# EAGLE design PentaFnord_CtrlBoard_0_91 (EAGLE 6.2)
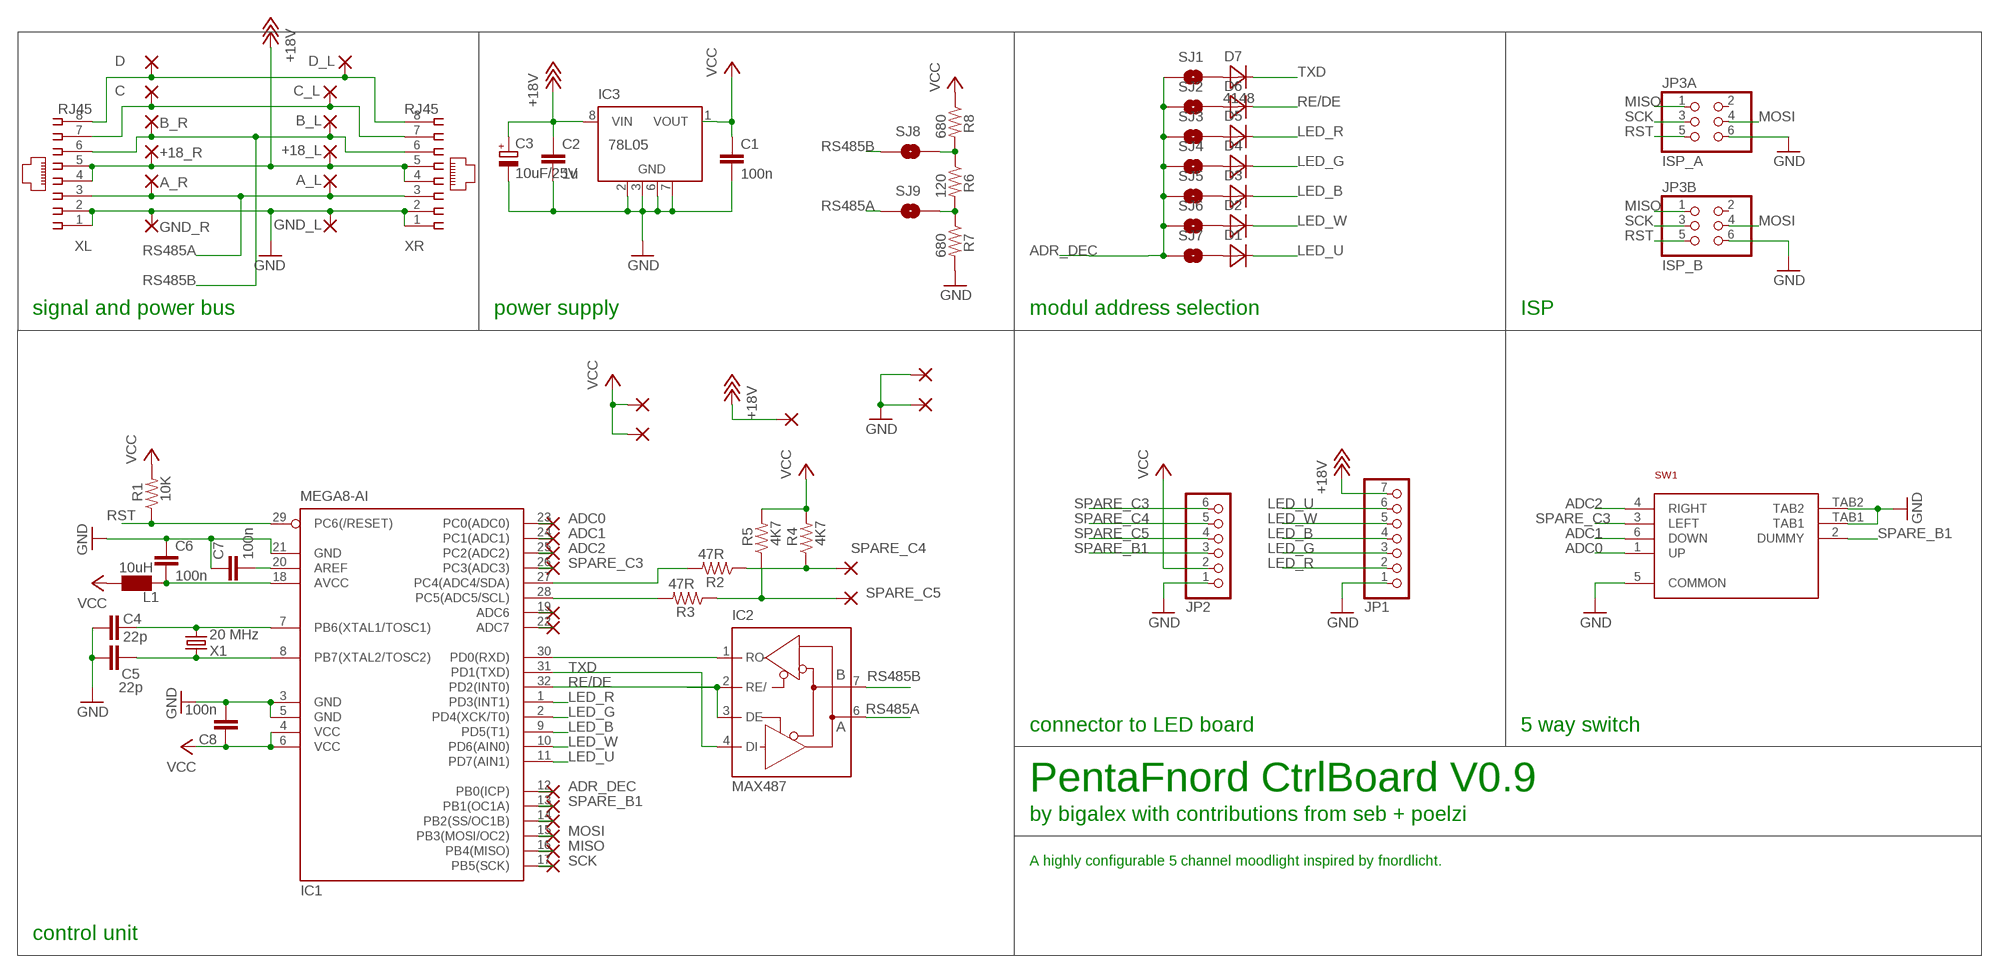
[diagram p0: schematic, sheet 1]

## Parts
+18_L  WIREPADSMD2,54-5,08  [SMD2,54-5,08]
+18_R  WIREPADSMD2,54-5,08  [SMD2,54-5,08]
A_L  WIREPADSMD1,27-254  [SMD1,27-2,54]
A_R  WIREPADSMD1,27-254  [SMD1,27-2,54]
ADC6  WIREPADSMD1,27-254  [SMD1,27-2,54]
ADC7  WIREPADSMD1,27-254  [SMD1,27-2,54]
B_L  WIREPADSMD1,27-254  [SMD1,27-2,54]
B_R  WIREPADSMD1,27-254  [SMD1,27-2,54]
C  WIREPADSMD1,27-254  [SMD1,27-2,54]
C1  100n  CAP0805  [0805]
C2  1u  CAP0805  [0805]
C3  10uF/25V  CPOL-EUSMCD  [SMC_D]
C4  22p  CAP0805  [0805]
C5  22p  CAP0805  [0805]
C6  100n  CAP0805  [0805]
C7  100n  CAP0805  [0805]
C8  100n  CAP0805  [0805]
C_L  WIREPADSMD1,27-254  [SMD1,27-2,54]
D  WIREPADSMD1,27-254  [SMD1,27-2,54]
D1  DIODE_0805  [DIODE_0805]
D2  DIODE_0805  [DIODE_0805]
D3  DIODE_0805  [DIODE_0805]
D4  DIODE_0805  [DIODE_0805]
D5  DIODE_0805  [DIODE_0805]
D6  DIODE_0805  [DIODE_0805]
D7  4148  DIODE_0805  [DIODE_0805]
D_L  WIREPADSMD1,27-254  [SMD1,27-2,54]
GND_L  WIREPADSMD2,54-5,08  [SMD2,54-5,08]
GND_R  WIREPADSMD2,54-5,08  [SMD2,54-5,08]
IC1  MEGA8-AI  [TQFP32-08]
IC2  MAX487  [SO08]
IC3  78L05  78L05SMD  [SO08]
JP1  PINHD-1X07_2.54-SMD-REVERSE  [1X07SMD-REVERSE]
JP2  PINHD-1X06_2.54-SMD  [1X06SMD]
JP3A  ISP_A  PINHD-2X03_2.54-SMD  [2X03SMD]
JP3B  ISP_B  PINHD-2X03_2.54-SMD  [2X03SMD]
L1  10uH  BEAD  [0805]
PAD1  WIREPADSMD1,27-254  [SMD1,27-2,54]
PAD2  WIREPADSMD1,27-254  [SMD1,27-2,54]
PAD3  WIREPADSMD1,27-254  [SMD1,27-2,54]
PAD4  WIREPADSMD1,27-254  [SMD1,27-2,54]
PAD5  WIREPADSMD1,27-254  [SMD1,27-2,54]
PB0  WIREPADSMD1,27-254  [SMD1,27-2,54]
PB1  WIREPADSMD1,27-254  [SMD1,27-2,54]
PB2  WIREPADSMD1,27-254  [SMD1,27-2,54]
PB3  WIREPADSMD1,27-254  [SMD1,27-2,54]
PB4  WIREPADSMD1,27-254  [SMD1,27-2,54]
PB5  WIREPADSMD1,27-254  [SMD1,27-2,54]
PC0  WIREPADSMD1,27-254  [SMD1,27-2,54]
PC1  WIREPADSMD1,27-254  [SMD1,27-2,54]
PC2  WIREPADSMD1,27-254  [SMD1,27-2,54]
PC3  WIREPADSMD1,27-254  [SMD1,27-2,54]
PC4  WIREPADSMD1,27-254  [SMD1,27-2,54]
PC5  WIREPADSMD1,27-254  [SMD1,27-2,54]
R1  10K  RESISTOR0805-RES  [0805]
R2  47R  RESISTOR0805-RES  [0805]
R3  47R  RESISTOR0805-RES  [0805]
R4  4K7  RESISTOR0805-RES  [0805]
R5  4K7  RESISTOR0805-RES  [0805]
R6  120  RESISTOR0805-RES  [0805]
R7  680  RESISTOR0805-RES  [0805]
R8  680  RESISTOR0805-RES  [0805]
SJ1  SOLDERJUMPERNO  [SJ_2S-NO]
SJ2  SOLDERJUMPERNO  [SJ_2S-NO]
SJ3  SOLDERJUMPERNO  [SJ_2S-NO]
SJ4  SOLDERJUMPERNO  [SJ_2S-NO]
SJ5  SOLDERJUMPERNO  [SJ_2S-NO]
SJ6  SOLDERJUMPERNO  [SJ_2S-NO]
SJ7  SOLDERJUMPERNO  [SJ_2S-NO]
SJ8  SOLDERJUMPERNO  [SJ_2S-NO]
SJ9  SOLDERJUMPERNO  [SJ_2S-NO]
SW1  MCMT5-F-VADAPTED_FOOTPRINT  [MCMT5-F-V_ADAPTED]
X1  20 MHz  CRYSTALSMD-SMALLER  [HC49UP-SMALL]
XL  RJ45  RJ45-SMDRJ45-SMALL  [85502-5008-SMALL]
XR  RJ45  RJ45-SMDRJ45-SMALL  [85502-5008-SMALL]

## Nets
+18V: +18_L.1(P) +18_R.1(P) C2.1 C3.+ IC3.8(VIN) JP1.7 PAD2.1(P) XL.4 XL.5 XR.4 XR.5
ADC0: IC1.23(PC0(ADC0)) PC0.1(P) SW1.1(UP)
ADC1: IC1.24(PC1(ADC1)) PC1.1(P) SW1.6(DOWN)
ADC2: IC1.25(PC2(ADC2)) PC2.1(P) SW1.4(RIGHT)
ADR_DEC: IC1.12(PB0(ICP)) PB0.1(P) SJ1.1 SJ2.1 SJ3.1 SJ4.1 SJ5.1 SJ6.1 SJ7.1
GND: C1.2 C2.2 C3.- C4.1 C5.1 C6.1 C7.1 C8.2 GND_L.1(P) GND_R.1(P) IC1.3(GND) IC1.5(GND) IC1.21(GND) IC3.2(GND) IC3.3(GND) IC3.6(GND) IC3.7(GND) JP1.1 JP2.1 JP3A.6 JP3B.6 PAD1.1(P) PAD5.1(P) R7.2 SW1.5(COMMON) SW1.TAB1 SW1.TAB2 XL.1 XL.2 XR.1 XR.2
LED_B: D3.1(C) IC1.9(PD5(T1)) JP1.4
LED_G: D4.1(C) IC1.2(PD4(XCK/T0)) JP1.3
LED_R: D5.1(C) IC1.1(PD3(INT1)) JP1.2
LED_U: D1.1(C) IC1.11(PD7(AIN1)) JP1.6
LED_W: D2.1(C) IC1.10(PD6(AIN0)) JP1.5
MISO: IC1.16(PB4(MISO)) JP3A.1 JP3B.1 PB4.1(P)
MOSI: IC1.15(PB3(MOSI/OC2)) JP3A.4 JP3B.4 PB3.1(P)
N$1: C.1(P) C_L.1(P) XL.7 XR.7
N$2: D.1(P) D_L.1(P) XL.8 XR.8
N$4: ADC6.1(P) IC1.19(ADC6)
N$9: ADC7.1(P) IC1.22(ADC7)
N$30: C6.2 IC1.18(AVCC) L1.2
N$31: R6.1 R8.2 SJ8.2
N$32: IC1.30(PD0(RXD)) IC2.1(RO)
N$35: C5.2 IC1.8(PB7(XTAL2/TOSC2)) X1.2
N$36: C4.2 IC1.7(PB6(XTAL1/TOSC1)) X1.1
N$38: R6.2 R7.1 SJ9.2
N$44: C7.2 IC1.20(AREF)
N$45: D7.2(A) SJ1.2
N$46: D6.2(A) SJ2.2
N$47: D5.2(A) SJ3.2
N$48: D4.2(A) SJ4.2
N$50: D3.2(A) SJ5.2
N$51: D2.2(A) SJ6.2
N$52: D1.2(A) SJ7.2
N$53: IC1.28(PC5(ADC5/SCL)) R3.2
N$55: IC1.14(PB2(SS/OC1B)) PB2.1(P)
N$59: IC1.27(PC4(ADC4/SDA)) R2.2
RE/DE: D6.1(C) IC1.32(PD2(INT0)) IC2.2(RE/) IC2.3(DE)
RS485A: A_L.1(P) A_R.1(P) IC2.6(A) SJ9.1 XL.3 XR.3
RS485B: B_L.1(P) B_R.1(P) IC2.7(B) SJ8.1 XL.6 XR.6
RST: IC1.29(PC6(/RESET)) JP3A.5 JP3B.5 R1.1
SCK: IC1.17(PB5(SCK)) JP3A.3 JP3B.3 PB5.1(P)
SPARE_B1: IC1.13(PB1(OC1A)) JP2.3 PB1.1(P) SW1.2(DUMMY)
SPARE_C3: IC1.26(PC3(ADC3)) JP2.6 PC3.1(P) SW1.3(LEFT)
SPARE_C4: JP2.5 PC4.1(P) R2.1 R4.1
SPARE_C5: JP2.4 PC5.1(P) R3.1 R5.1
TXD: D7.1(C) IC1.31(PD1(TXD)) IC2.4(DI)
VCC: C1.1 C8.1 IC1.4(VCC) IC1.6(VCC) IC3.1(VOUT) JP2.2 L1.1 PAD3.1(P) PAD4.1(P) R1.2 R4.2 R5.2 R8.1
Unconnected: IC3.4(NC) IC3.5(NC) JP3A.2 JP3B.2

## Notes on the sheet
- signal and power bus | power supply | modul address selection | ISP
- connector to LED board | 5 way switch
- PentaFnord CtrlBoard V0.9
- by bigalex with contributions from seb + poelzi
- A highly configurable 5 channel moodlight inspired by fnordlicht.
- control unit

## Power pins joined to a net without a drawn wire
GND: IC2.5(GND)
VCC: IC2.8(VCC)

## Library data of the parts
+18_L +18_R A_L A_R ADC6 ADC7 B_L B_R C C_L D D_L GND_L GND_R PAD1-PAD5 PB0 PB1-PB5 PC0 PC1-PC5 = wirepad:WIREPAD: Wire PAD connect wire on PCB
C1 C2 C4-C8 = SparkFun:CAP: Capacitor Standard 0603 ceramic capacitor, and 0.1" leaded capacitor.
C3 = rcl:CPOL-EU: POLARIZED CAPACITOR, European symbol
D1-D7 = seb:DIODE_0805
IC1 = atmel:MEGA8: MICROCONTROLLER 8 Kbytes FLASH, 1 kbytes SRAM, 512 bytes EEPROM, USART, 6-channel 10 bit ADC, 2-channel 8 bit ADC Pin compatible with Atmega48, ATMega88, ATMega168 Source: avr.lbr; MPN: ATMEGA8-16AU; OC_FARNELL: 9171371; OC_NEWARK: 73M8863
IC2 = Alex_personal:MAX487: RS485 TRANSEIVER; MF: MAXIM; MPN: MAX487; OC_FARNELL: unknown; OC_NEWARK: unknown
IC3 = linear:78L*SMD: Positive VOLTAGE REGULATOR
JP1 = Alex_personal:PINHD-1X07: PIN HEADER
JP2 = pinhead-2:PINHD-1X06: PIN HEADER
JP3A JP3B = pinhead-2:PINHD-2X03: PIN HEADER
L1 = seb:BEAD
R1-R8 = SparkFun:RESISTOR: Resistor Basic schematic elements and footprints for 0603, 1206, and PTH resistors.
SJ1-SJ9 = SparkFun:SOLDERJUMPER: Solder Jumper Standard SMD solder jumper. Used to automate production. Two varients : Normally Open and Normally Closed are the same, but have different paste layers. NC will have a large amount of paste and should jumper during reflow.
SW1 = alex3:MCMT5-F-V
X1 = Alex_personal:CRYSTAL: Crystals Various standard crystals. Proven footprints. Spark Fun Electronics SKU : COM-00534
XL XR = Alex_personal:RJ45-SMD: AMP connector

## Board
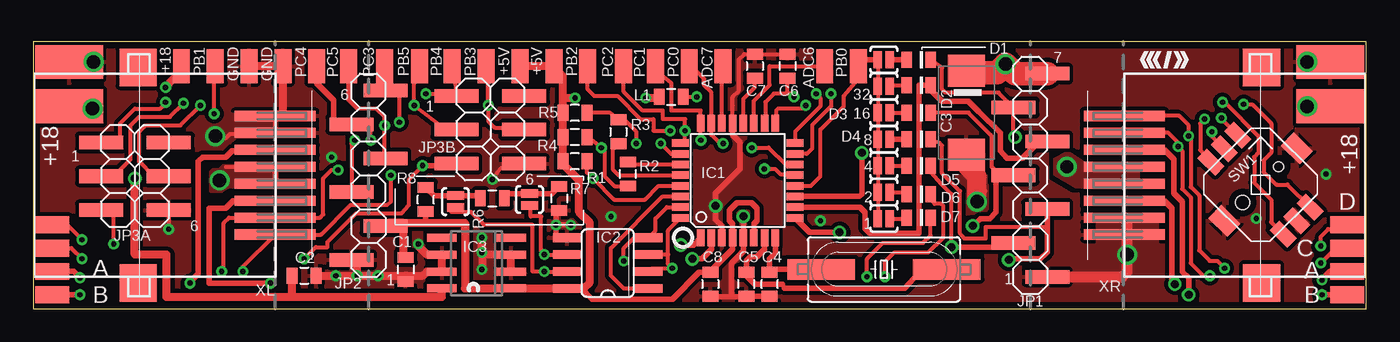
[diagram p1: board, top side]
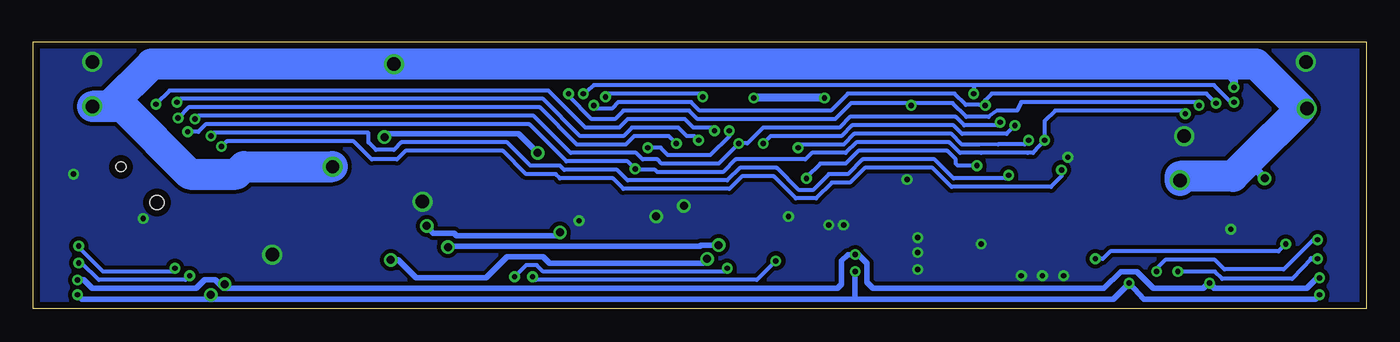
[diagram p2: board, bottom side, seen from below]

Size 100 x 20 mm. Coordinates in mm from the lower left corner, seen from the top.
Outline: 100,0 100,20 0,20 0,0 100,0
Copper layers (1*16): Top 0.035mm / dielectric 1.5mm / Bottom 0.035mm
Design rules: minimum track width 12mil, minimum drill 0.4mm, track to track 10mil, track to pad 10mil, pad to pad 8mil, via to via 10mil, smd to smd 8mil, copper to edge 20mil, drill to drill 8mil, minimum pad ring 10mil, minimum via ring 8mil, stop-mask expansion 4mil, vias tented up to drill 40mil, thermal gap 10mil

### Footprints (pad centres in the part's own frame; a part is rotated, then mirrored left to right if it is on the bottom)
SMD2,54-5,08 = smd 2.54 x 5.08: 1 0,0
SMD1,27-2,54 = smd 1.27 x 2.54: 1 0,0
0805 = smd 0.8 x 1.2: 1 -0.9,0; 2 0.9,0
SMC_D = smd 2.4 x 2.8: + -3.15,0; - 3.15,0
DIODE_0805 = smd 0.8 x 1.2: 1 -0.9,0; 2 0.9,0
TQFP32-08 = smd 1.27 x 0.559: 1 -4.293,2.8; 2 -4.293,2; 3 -4.293,1.2; 4 -4.293,0.4; 5 -4.293,-0.4; 6 -4.293,-1.2; 7 -4.293,-2; 8 -4.293,-2.8; 17 4.293,-2.8; 18 4.293,-2; 19 4.293,-1.2; 20 4.293,-0.4; 21 4.293,0.4; 22 4.293,1.2; 23 4.293,2; 24 4.293,2.8 | smd 0.559 x 1.27: 9 -2.8,-4.293; 10 -2,-4.293; 11 -1.2,-4.293; 12 -0.4,-4.293; 13 0.4,-4.293; 14 1.2,-4.293; 15 2,-4.293; 16 2.8,-4.293; 25 2.8,4.293; 26 2,4.293; 27 1.2,4.293; 28 0.4,4.293; 29 -0.4,4.293; 30 -1.2,4.293; 31 -2,4.293; 32 -2.8,4.293
SO08 = smd 0.66 x 2.032: 1 -1.905,-3.073; 2 -0.635,-3.073; 3 0.635,-3.073; 4 1.905,-3.073; 5 1.905,3.073; 6 0.635,3.073; 7 -0.635,3.073; 8 -1.905,3.073
SO08' = smd 0.6 x 2.2: 1 -1.905,-2.6; 2 -0.635,-2.6; 3 0.635,-2.6; 4 1.905,-2.6; 5 1.905,2.6; 6 0.635,2.6; 7 -0.635,2.6; 8 -1.905,2.6
1X07SMD-REVERSE = smd 1.016 x 3.302: 1 -1.27,-1.27; 2 1.27,1.27; 3 3.81,-1.27; 4 6.35,1.27; 5 8.89,-1.27; 6 11.43,1.27; 7 13.97,-1.27
1X06SMD = smd 1.016 x 3.302: 1 -1.27,1.27; 2 1.27,-1.27; 3 3.81,1.27; 4 6.35,-1.27; 5 8.89,1.27; 6 11.43,-1.27
2X03SMD = smd 1.016 x 3.302: 1 -1.27,-3.81; 2 -1.27,1.27; 3 1.27,-3.81; 4 1.27,1.27; 5 3.81,-3.81; 6 3.81,1.27
SJ_2S-NO = smd 0.635 x 1.27: 1 -0.45,0; 2 0.45,0
MCMT5-F-V_ADAPTED = smd 1.858 x 1: 1 -3.829,1.425; 2 -3.829,0; 3 -3.829,-1.425; 4 3.829,1.425; 5 3.829,0; 6 3.829,-1.425 | smd 2 x 1.394: TAB1 0,3.847; TAB2 0,-3.847 | hole 1.05: 0,-1.9 | hole 0.75: 0,1.9
HC49UP-SMALL = smd 5.08 x 1.524: 1 -4.699,0; 2 4.699,0
85502-5008-SMALL = smd 6.096 x 0.762: 1 10.211,4.445; 2 10.211,3.175; 3 10.211,1.905; 4 10.211,0.635; 5 10.211,-0.635; 6 10.211,-1.905; 7 10.211,-3.175; 8 10.211,-4.445 | smd 2.794 x 2.794: P$1 -0.076,-8.077; P$2 -0.076,8.077

### Placement (x,y rotation side)
+18_L  2.7,15.16 90 top
+18_R  97.31,15.16 90 top
A_L  1.43,2.78 90 top
A_R  98.58,2.78 90 top
ADC6  59.37,18.18 0 top
ADC7  51.75,18.18 180 top
B_L  1.43,1.04 90 top
B_R  98.58,1.04 90 top
C  98.58,4.53 90 top
C1  27.94,2.94 270 top
C2  20.32,2.46 0 top
C3  70.01,14.69 270 top
C4  53.5,1.83 90 top
C5  55.24,1.83 90 top
C6  56.59,18.18 270 top
C7  54.13,18.18 270 top
C8  50.8,1.83 270 top
C_L  1.43,4.53 90 top
D  98.58,6.27 90 top
D1  66.44,18.66 180 top
D2  66.44,16.75 180 top
D3  66.44,14.69 180 top
D4  66.44,12.7 180 top
D5  66.44,10.72 180 top
D6  66.44,8.58 180 top
D7  66.44,6.83 180 top
D_L  1.43,6.27 270 top
GND_L  2.7,18.5 90 top
GND_R  97.31,18.5 90 top
IC1  52.86,9.61 90 top
IC2  43.1,3.42 90 top
IC3  78L05  [SO08']  33.26,3.42 90 top
JP1  74.8,3.65 90 top
JP2  25.15,4.92 90 top
JP3A  8.89,11.19 270 top
JP3B  35.56,14.69 270 top
L1  47.86,15.88 0 top
PAD1  16.19,18.18 0 top
PAD2  11.11,18.18 0 top
PAD3  39.05,18.18 0 top
PAD4  36.51,18.18 0 top
PAD5  18.73,18.18 0 top
PB0  61.91,18.18 180 top
PB1  13.65,18.18 180 top
PB2  41.59,18.18 180 top
PB3  33.97,18.18 180 top
PB4  31.43,18.18 180 top
PB5  28.97,18.18 180 top
PC0  49.21,18.18 0 top
PC1  46.67,18.18 0 top
PC2  44.29,18.18 0 top
PC3  26.35,18.18 0 top
PC4  21.27,18.18 0 top
PC5  23.65,18.18 0 top
R1  40.64,11.04 180 top
R2  44.61,10.08 90 top
R3  43.89,13.26 270 top
R4  40.64,12.86 180 top
R5  40.64,14.69 180 top
R6  34.45,8.26 0 top
R7  39.45,8.26 270 top
R8  29.45,8.18 90 top
SJ1  63.82,6.75 0 top
SJ2  63.82,8.73 0 top
SJ3  63.82,10.72 0 top
SJ4  63.82,12.7 0 top
SJ5  63.82,14.69 0 top
SJ6  63.82,16.67 0 top
SJ7  63.82,18.66 0 top
SJ8  31.67,8.02 90 top
SJ9  37.23,8.18 90 top
SW1  92.08,9.29 315 top
X1  63.82,2.94 180 top
XL  7.94,10 0 top
XR  92.08,10 180 top

### Tracks (layer width: path | path; a pad name or v marks a point on that pad's centre or on a via)
+18V  (via drill 0.4, 0.6, 1)
  Top 0.305: 11.11,17.86 PAD2.1 | +18_L.1 | 14.45,10.63 XL.4
  Top 0.406: 97.16,15.16 +18_R.1 | XL.4 XL.5 | XR.5 81.76,10.62 | v4.45,15.01 +18_L.1 1.59,14.53 | 13.49,9.45 14.13,9.61 | 97.16,15.16 | v95.57,15.16 97.16,15.16
  Top 0.61: 19.53,0.88 30.66,0.88 IC3.8 | C2.1 19.42,0.98 19.53,0.88 | JP1.7 75.64,17.62 75.56,17.7 | v9.92,16.59 11.11,17.86 | 70.14,17.7 arc-90 C3.+ | v7.62,9.77 7.62,4.05 10,4.05 10,0.88 19.53,0.88
  Top 1.778: 70.14,17.7 72.31,17.7 v72.95,18.34 73.67,17.62 JP1.7
  Bottom 0.305: 9.53,18.33 10.32,17.54 | 5.4,14.53 4.6,14.53 4.45,14.37 v4.45,15.01 5.56,14.53 5.4,14.53 | 4.92,15.01 5.4,14.53 | v13.97,9.61 14.45,10.4 14.45,9.92 13.97,9.92
  Bottom 0.406: 42.55,18.81 43.34,18.81 43.34,18.33 | 73.74,17.7 74.14,18.34 77.95,18.33
  Bottom 0.61: 10.32,17.54 9.92,17.14 v9.92,16.59 | 73.74,17.7 73.1,18.34 v72.95,18.34 | v7.62,9.77 8.81,11.12
  Bottom 2.311: v13.97,9.61 13.97,9.92 10,9.92 8.81,11.12 4.92,15.01 8.25,18.33 9.53,18.33 43.34,18.33 77.95,18.33 91.13,18.33 94.3,15.16 v95.57,15.16 93.34,15.16 88.27,10.08 84.77,10.08 84.22,10.64 v77.55,10.64
  pour Top (no thermals): 82.87,10.88 82.87,9.13 78.26,9.13 76.68,10.08 76.68,11.19 77.63,11.67 78.9,10.88
  pour Top (no thermals): 13.49,10.4 13.97,10.4 14.29,10.72 18.1,10.72 18.26,10.56 18.26,9.45 15.24,9.45 14.92,9.13 14.61,9.13 14.13,8.81 13.34,8.81 13.34,10.24
ADC0  (via drill 0.4)
  Top 0.305: PC0.1 49.37,17.23 | 49.37,17.23 | PC0.1 49.21,17.39 | PC0.1 49.37,18.18 50.32,17.23 50.32,16.75 50.86,16.21 IC1.23 50.86,13.04 51.51,12.39 v51.75,12.39 | v89.14,14.29 89.14,14.24 SW1.1
  Bottom 0.305: v51.75,12.39 52.31,12.94 54.93,12.94 55.56,12.31 59.21,12.31 61.99,15.08 88.34,15.08 v89.14,14.29
ADC1  (via drill 0.4, 0.4 pad 0.01)
  Top 0.305: PC1.1 46.83,18.02 46.83,17.7 46.91,17.7 47.86,16.91 47.86,14.85 50.07,14.85 IC1.24 50.06,12.65 v50.09,12.62 | SW1.6 92.87,6.48 92.87,8.18 91.6,9.45 91.6,11.35 91.92,11.67 91.92,12.94 89.38,15.48 v89.22,15.48
  Bottom 0.305: v50.09,12.62 50.4,12.94 50.96,12.94 51.59,13.58 55.09,13.58 55.72,12.94 58.98,12.94 61.75,15.72 88.98,15.72 v89.22,15.48
ADC2  (via drill 0.4)
  Top 0.305: IC1.25 48.9,12.41 v48.9,13.34 48.9,14.21 47.23,14.21 47.23,14.85 45.72,14.85 44.29,16.28 PC2.1 | SW1.4 94.09,9.29 93.27,9.29 92.31,10.24 92.31,11.12 92.87,11.67 92.87,13.89 91.44,15.32 v90.81,15.32
  Bottom 0.305: v48.9,13.34 49.13,13.58 50.48,13.58 51.12,14.21 55.4,14.21 56.04,13.58 58.58,13.58 61.36,16.35 89.77,16.35 v90.81,15.32
ADR_DEC
  Top 0.305: SJ7.1 SJ6.1 | 62.05,18.61 61.91,18.47 61.91,17.23 60.8,15.96 60.8,15.16 59.05,13.42 59.05,9.92 58.34,9.21 IC1.12 57.08,9.13 | SJ1.1 63.37,6.35 SJ2.1 SJ3.1 SJ4.1 | SJ6.1 | SJ6.1 | SJ6.1 SJ5.1 SJ4.1 | SJ4.1
  Top 0.406: PB0.1 62.05,18.61 62.07,18.66 SJ7.1
GND  (via drill 0.4, 0.6, 1)
  Top 0.305: C7.1 53.34,19.08 52.94,18.68 52.94,16.35 52.46,15.88 52.46,15.25 IC1.21 | 36.83,10.56 35.08,10.56 v34.45,9.69 | C7.1 | C7.1 C6.1 | 88.58,6.59 SW1.TAB2 | XL.1 XL.2 18.2,13.1 14.76,13.1 14.45,12.78 | v13.65,12.94 14.45,12.78 | 13.65,13.26 13.97,13.26 14.45,12.78 | 13.65,12.39 13.57,12.54 13.18,12.94 | JP3A.6 v10.16,5.96 | JP3A.6
  Top 0.406: 96.52,17.86 GND_R.1 | IC2.5 39.21,5.32 v39.21,6.27 | v39.21,6.27 v40.32,6.27 | 36.83,10.56 JP3B.6 | R7.2 39.21,7.12 v39.21,6.27 | IC1.21 52.46,13.02 53.02,12.47 53.02,10.48 51.2,8.66 v51.2,7.7 51.2,6.67 51.66,6.2 IC1.3 | 53.26,4.29 IC1.5 v53.26,6.91 | 52.39,0.88 53.45,0.88 C4.1 C5.1 | 53.26,4.29 | 53.26,4.29 52.39,3.42 52.39,0.88 | 52.39,0.88 50.85,0.88 C8.2
  Top 0.61: 10.95,7.38 JP3A.6 9.84,7.54 | 3.02,18.18 3.49,18.18 3.25,17.94 3.02,18.18 | 3.02,18.18 GND_L.1 | 3.02,18.18 | 22.54,3.73 23.79,3.73 JP2.1 24.29,3.24 v24.29,2.46 | C2.2 v22.7,2.46 | v22.7,2.46 | v22.7,2.46 v24.29,2.46 | v24.29,2.46 | v24.29,2.46 27.94,2.46 | 27.94,2.46 29.21,2.46 29.53,2.78 IC3.7 IC3.6 29.53,4.05 28.89,4.69 v28.89,4.84 | 27.94,2.46 C1.2 | IC3.2 IC3.3 33.81,4.05 arc-90 v33.66,4.21 | v33.66,4.21 v33.66,2.94 | v33.66,4.21 v33.66,5.32 | PAD1.1 PAD5.1 18.73,14.45 XL.1 | 71.28,8.81
  Top 0.813: 82.07,5.89 82.07,6.49 XR.2 | 82.07,5.89 v82.07,4.05 82.07,2.78 81.67,2.38 JP1.1 | 82.07,5.89 XR.1
  Top 1.422: v70.8,8.02 70.8,8.66 70.8,9.92 70.01,10.72 C3.-
  other vias: 4.52,18.5 95.57,18.5 97,10.08 91.76,6.75 25.88,2.46 43.34,6.91 22.38,11.35 59.05,6.59
  pour Bottom (isolate 0.305): -0.16,-0.08 100.17,-0.08 100.17,20.09 -0.16,20.09
  pour Top (isolate 0.305, rank 2): 100.17,20.09 100.17,-0.08 -0.16,-0.08 -0.16,20.09
  pour Top (no thermals): 79.85,3.42 79.85,6.59 84.3,6.59 84.3,3.42
  pour Top (no thermals): 18.26,14.53 14.76,14.53 13.97,13.58 13.02,13.26 13.02,12.47 13.34,12.15 13.81,12.15 14.13,12.47 14.76,12.47 15.24,12.94 18.26,12.94
LED_B  (via drill 0.6)
  Top 0.305: 73.18,9.77 73.3,9.77 JP1.4 | D3.1 70.17,14.69 71.91,12.94 71.91,10.63 72.55,10
  Top 0.406: IC1.9 58.24,5.72 v60.48,5.72 | 72.31,10 72.23,10.08 | 72.31,10 72.55,10 JP1.4 | v70.48,6.2 71.04,6.75 71.75,6.75 72.23,7.23 72.23,9.92 72.31,10
  Bottom 0.406: v70.48,6.2 70.01,5.64 68.42,5.64 68.26,5.48 60.72,5.48 v60.48,5.72
LED_G  (via drill 0.6)
  Top 0.305: D4.1 67.5,12.47 67.94,12.47 68.18,12.23 68.18,10.16 69.53,8.81 69.53,5.64 69.85,5.24 71.44,5.24 71.44,6.11 75.75,6.11 arc-90 76.07,5.8
  Top 0.406: IC1.2 50.86,4.43 50.16,3.73 v49.45,3.73 | JP1.3 76.07,5.8 76.07,4.24 75.56,3.73 73.26,3.73 v73.18,3.65
  Bottom 0.406: v73.18,3.65 72.63,3.65 71.28,2.3 66.04,2.3 64.45,3.89 61.75,3.89 61.28,3.42 49.77,3.42 v49.45,3.73
LED_R  (via drill 0.6)
  Top 0.305: D5.1 67.34,10.22 68.18,9.29 68.9,8.58 v68.9,4.61
  Top 0.406: JP1.2 72.16,4.92 72.07,5 72.07,4.61 v68.9,4.61 | IC1.1 49.51,4.77 v48.58,4.77
  Bottom 0.406: v68.9,4.61 arc90 68.82,4.69 50,4.69 49.92,4.77 v48.58,4.77
LED_U  (via drill 0.6)
  Top 0.305: D1.1 68.18,18.05 68.18,16.43 68.42,16.2 72.42,16.2 JP1.6 73.53,12.99 v73.66,12.86
  Top 0.406: IC1.11 61.98,8.41 62.15,8.58 v62.15,11.67
  Bottom 0.406: v73.66,12.86 73.42,13.1 63.58,13.1 v62.15,11.67
LED_W
  Top 0.406: JP1.5 76.12,12.54 | D2.1 66.44,16.75 66.44,5.64 62.79,5.64 62.39,6.04 62.39,7.23 62.01,7.61 IC1.10 | D2.1 | 70.96,14.77 | D2.1 67.47,16.62 67.47,16.27 68.18,15.56 70.17,15.56 70.96,14.77 | JP1.5 75.99,12.46 | 70.96,14.77 72.55,13.18 72.55,11.83 73.03,11.27 74.22,11.27 75.48,12.54 JP1.5
MISO  (via drill 0.4)
  Top 0.305: PB4.1 31.59,18.02 JP3B.1 31.59,16.12 v29.45,16.12 | IC1.16 57.16,13.27 59.05,15.16 59.05,15.8 v58.74,16.12 | 5.08,12.62 5.24,12.78 6.51,12.78 6.51,13.89 7.62,15.01 9.53,15.01 9.92,15.4 v9.92,15.48
  Top 0.406: JP3A.1 5.08,12.62 4.92,12.47
  Bottom 0.305: v58.74,16.12 57.94,16.75 29.37,16.75 | 29.37,16.75 11.43,16.75 10.16,15.48 v9.92,15.48 | v29.45,16.12 29.45,16.67 arc90 29.37,16.75
MOSI  (via drill 0.4)
  Top 0.305: JP3B.4 36.67,13.58 34.61,13.58 34.13,14.05 v34.13,15.24 34.13,15.09 34.13,18.02 PB3.1 | IC1.15 58.04,11.61 58.42,11.99 58.42,13.73 59.85,15.16 v59.85,16.12 | JP3A.4 9.05,9.92 7.94,11.04 7.94,13.26 8.41,13.73 11.03,13.73 v12.54,15.24
  Bottom 0.305: v59.85,16.12 59.85,15.96 58.1,14.21 56.36,14.21 55.72,14.85 50.8,14.85 50.16,14.21 39.85,14.21 38.66,15.4 34.13,15.4 | 34.13,15.4 v34.13,15.24 | 34.13,15.4 | v12.54,15.24 12.78,15.48 25.88,15.48 26.19,14.85 27.7,14.85 28.34,14.37 30,14.37 31.04,15.4 34.13,15.4
N$1  (via drill 0.4)
  Top 0.305: XR.7 85.17,13.17 85.88,12.47 v85.88,12.15 86.2,11.83 86.2,8.97 86.84,8.34 86.84,3.42 87.79,2.46 v88.27,2.46 | 97.79,4.53 C.1 97.71,4.53 v96.6,3.42 | v22.86,10.4 22.38,10.4 21.75,9.77 21.75,7.07 21.51,6.82 XL.7 14.68,6.82 14.29,6.43 14.29,2.78 v14.13,2.78 | C_L.1 2.86,4.53 v3.65,3.73
  Bottom 0.305: v85.88,12.15 85.49,12.54 75.96,12.54 74.61,11.2 72.71,11.2 72.07,11.83 64.77,11.83 63.02,10.08 60.8,10.08 60.48,9.77 56.52,9.77 55.72,8.97 47.78,8.97 46.83,9.92 44.45,9.92 42.78,8.26 41.27,8.26 40.08,9.45 38.73,9.45 37.62,10.56 32.54,10.56 31.11,9.13 23.65,9.13 22.86,9.92 v22.86,10.4 | v88.27,2.46 88.58,2.15 95.09,2.15 96.36,3.42 v96.6,3.42 | 4.13,3.73 5.56,2.23 10.79,2.23 11.35,2.78 13.02,2.78 | 13.02,2.78 | 13.02,2.78 v14.13,2.78
  Bottom 0.406: v3.65,3.73 4.13,3.73
N$2  (via drill 0.4)
  Top 0.305: XR.8 85.97,14.45 86.68,13.73 v86.68,12.94 86.84,12.78 86.84,9.13 87.47,8.5 87.47,4.37 88.27,3.57 88.82,3.57 v89.38,3.02 | XL.8 18.15,5.64 | v26.83,10 26.83,8.02 26.51,7.78 23.81,7.78 21.59,5.55 XL.8 | D_L.1 2.54,6.27 v3.65,5.16 | v15.72,2.78 15.72,3.12 XL.8 | D.1 98.27,5.96 97.16,5.96 96.6,5.4 v96.6,4.69
  Bottom 0.305: v86.68,12.94 86.52,13.18 74.85,13.18 74.85,12.47 74.3,11.91 72.94,11.91 72.39,12.47 64.45,12.47 62.71,10.72 60.48,10.72 60.17,10.4 56.2,10.4 55.4,9.61 47.94,9.61 46.99,10.56 44.21,10.56 42.55,8.89 41.51,8.89 40.32,10.08 38.89,10.08 37.78,11.2 32.38,11.2 30.96,9.77 27.07,9.77 v26.83,10 | v89.38,3.02 89.61,2.78 94.77,2.78 96.6,4.61 v96.6,4.69 | v3.65,5.16 3.97,5.16 6.19,2.94 10.64,2.94 11.35,3.65 15.08,3.65 15.72,3.02 v15.72,2.78
N$4
  Top 0.305: ADC6.1 56.04,18.18 55.24,18.18 55.24,16.75 54.06,15.57 IC1.19
N$9
  Top 0.305: 51.59,18.02 ADC7.1 51.66,18.18 51.66,15.09 IC1.22
N$30  (via drill 0.4, 0.4 pad 0.4)
  Top 0.305: L1.2 v49.77,15.88 | IC1.18 54.93,13.96 54.93,15.48 55.56,16.12 56.52,16.12 | 56.52,16.12 56.83,16.12 v57.07,15.88 | C6.2 56.59,16.2 56.52,16.12
  Bottom 0.305: v57.07,15.88 56.83,16.12 50.01,16.12 v49.77,15.88
N$31
  Top 0.406: R6.1 33.55,8.47 SJ8.2 30.06,8.47 R8.2
N$32
  Top 0.305: 45.32,1.67 46.02,1.67 IC2.1 44.29,1.51 43.34,2.46 43.34,4.53 47.22,8.41 IC1.30
N$35
  Top 0.406: IC1.8 55.66,4.15 55.24,3.73 C5.2 55.46,2.94 X1.2
N$36
  Top 0.406: IC1.7 54.86,4.46 54.29,3.89 53.82,3.89 53.5,3.57 C4.2 | C4.2 | X1.1 66.67,2.94 65.41,1.51 56.36,1.51 56.2,1.83 54.13,1.83 53.5,2.46 C4.2 | C4.2
N$38
  Top 0.406: R7.1 38.92,8.63 SJ9.2 35.35,8.63 R6.2
N$44
  Top 0.305: IC1.20 53.26,15.72 54.13,16.59 C7.2
N$45
  Top 0.305: SJ1.2 65.54,6.75 D7.2
N$46
  Top 0.305: SJ2.2 65.54,8.73 D6.2
N$47
  Top 0.305: SJ3.2 D5.2
N$48
  Top 0.406: SJ4.2 | SJ4.2 D4.2
N$50
  Top 0.305: SJ5.2 D3.2
N$51
  Top 0.305: SJ6.2 64.35,16.75 D2.2
N$52
  Top 0.406: D1.2 64.43,18.66 SJ7.2
N$53
  Top 0.305: R3.2 43.5,11.96 43.5,10.4 43.89,10.01 IC1.28
N$55  (via drill 0.4)
  Top 0.305: 41.91,17.86 PB2.1 41.59,16.43 42.07,15.96 43.81,15.96 45.56,14.21 46.51,14.21 46.51,13.34 v47.78,13.34 | IC1.14 56.43,10.81 55.17,12.07 v53.9,12.07
  Bottom 0.305: v47.78,13.34 47.78,12.94 49.21,11.51 52.39,11.51 52.94,12.07 v53.9,12.07
N$59
  Top 0.305: 48.81,10.81 IC1.27 44.59,10.81 arc90 R2.2
RE/DE  (via drill 0.4)
  Top 0.305: D6.1 67.34,8.15 67.63,7.86 68.1,7.86 68.26,7.7 68.26,5.32 67.15,4.21 64.61,4.21 63.9,3.5 v63.9,2.38 | IC1.32 47.62,5.86 47.62,4.05 | 47.62,4.05 IC2.3 | 47.62,4.05 47.62,3.34 v47.94,3.02 46.41,3.02 IC2.2
  Bottom 0.305: v63.9,2.38 63.02,3.26 62.23,3.26 61.75,2.78 48.18,2.78 v47.94,3.02 | v63.9,2.38
RS485A  (via drill 0.4, 0.6)
  Top 0.305: IC2.6 v38.34,4.05 38.1,4.29 38.1,6.91 37.31,6.91 37.31,7.65 SJ9.1
  Top 0.406: XL.3 15.79,11.91 15.72,11.83 14.92,11.83 14.45,11.35 12.7,11.35 12.38,11.04 12.38,2.62 11.75,1.99 v11.75,1.91 | 81.81,8.02 XR.3 84.86,8.09 85.41,7.54 85.41,2.07 v85.65,1.83 | v96.68,2.15 97.31,2.78 A_R.1 | v3.49,2.3 3.02,2.78 A_L.1
  Bottom 0.406: 85.72,1.51 39.69,1.51 39.37,1.83 39.37,3.57 38.89,4.05 v38.34,4.05 38.1,4.05 37.47,3.42 37.47,1.99 36.99,1.51 19.68,1.51 18.41,2.78 17.22,2.78 15.95,1.51 12.22,1.51 11.83,1.91 v11.75,1.91 11.43,1.59 11.43,1.51 4.45,1.51 3.65,2.3 v3.49,2.3 | v85.65,1.83 85.65,1.59 85.72,1.51 | 85.72,1.51 86.36,2.15 87.15,2.15 87.79,1.51 95.57,1.51 96.2,2.15 v96.68,2.15
RS485B  (via drill 0.4, 0.6)
  Top 0.305: IC2.7 v38.34,2.78 37.47,2.78 37.47,6.27 33.81,6.27 32.86,7.23 31.38,7.23 SJ8.1
  Top 0.406: XL.6 15,8.09 14.45,7.54 13.18,7.54 13.18,1.91 v17.78,1.91 | IC2.7 40.34,2.92 | XR.6 84.86,11.91 85.57,11.2 85.57,8.66 86.2,8.02 86.2,2.78 86.68,2.3 v86.68,1.04 | v96.68,1.04 B_R.1 | v96.68,1.04 | B_L.1 v3.49,1.04 | B_L.1
  Bottom 0.406: 38.34,0.72 86.68,0.72 | 89.69,0.72 | 38.34,0.72 v38.34,2.78 | 86.68,0.72 v86.68,1.04 | 86.68,0.72 89.69,0.72 | 89.69,0.72 96.36,0.72 v96.68,1.04 | v3.49,1.04 3.81,0.72 16.67,0.72 v17.78,1.91 18.97,0.72 38.34,0.72
RST  (via drill 0.4)
  Top 0.305: 31.59,11.04 JP3B.5 | R1.1 41.54,10.22 v41.99,9.77 43.58,8.18 45.88,8.18 46.91,9.21 IC1.29 | v29.21,10.72 28.18,9.69 28.18,7.78 27.62,7.15 24.21,7.15 22.07,5 22.07,4.61 21.19,4.61 v20.32,3.73 | v6.03,4.84 6.03,7.38
  Top 0.406: 31.59,11.04 31.27,10.72 v29.21,10.72 | JP3A.5 6.03,7.38
  Bottom 0.305: v29.21,10.72 30.64,10.72 30.8,10.88 30.8,11.2 31.43,11.83 38.1,11.83 39.05,10.88 40.96,10.88 41.99,9.85 v41.99,9.77 | v20.32,3.73 19.76,3.73 19.21,4.29 6.59,4.29 v6.03,4.84
SCK  (via drill 0.4)
  Top 0.305: JP3B.3 30.8,13.58 v28.57,15.24 28.57,16.91 28.89,17.23 PB5.1 29.05,18.02 | v57.94,15.24 57.71,15.01 55.88,15.01 55.72,14.85 55.72,13.96 IC1.17 | JP3A.3 6.03,9.92 7.3,11.2 7.3,13.73 7.94,14.37 10.24,14.37 v11.27,15.4
  Bottom 0.305: v11.27,15.4 11.99,16.12 28.1,16.12 28.57,15.64 v28.57,15.24 29.02,15.28 30.04,15.28 30.88,16.12 38.89,16.12 40.16,14.85 50.01,14.85 50.64,15.48 56.12,15.48 56.59,15.01 57.71,15.01 v57.94,15.24
SPARE_B1  (via drill 0.4)
  Top 0.305: PB1.1 13.97,17.86 13.57,17.47 v13.57,14.61 | JP2.3 23.88,12.37 v24.13,12.62 | IC1.13 57.08,10.08 56.04,10.08 55.64,10.48 v54.85,10.48 | v88.42,13.26 88.42,12.94 SW1.2
  Top 0.406: 25.24,8.66 23.95,8.66 JP2.3
  Bottom 0.305: v13.57,14.61 13.81,14.85 23.34,14.85 24.13,14.05 v24.13,12.62 25,11.67 25.4,11.67 28.89,11.67 30.48,11.67 31.27,12.47 38.26,12.47 39.05,11.67 41.59,11.67 42.07,11.2 47.31,11.2 48.26,10.24 53.18,10.24 53.34,10.4 54.77,10.4 v54.85,10.48 55.4,11.04 60.01,11.04 62.79,13.81 87.07,13.81 87.63,13.26 v88.42,13.26
SPARE_C3  (via drill 0.4)
  Top 0.305: PC3.1 26.42,18.18 JP2.6 27.46,16.35 v27.46,13.97 | IC1.26 47.85,11.61 v47.07,12.39 | SW1.3 87.55,11.88 87.55,13.89 v87.87,14.21
  Bottom 0.305: v27.46,13.97 27.62,13.73 30.16,13.73 30.8,14.37 38.73,14.37 39.53,13.58 45.24,13.58 46.43,12.39 v47.07,12.39 48.58,10.88 52.86,10.88 53.18,11.2 54.29,11.2 54.77,11.67 59.69,11.67 62.47,14.45 87.63,14.45 v87.87,14.21
SPARE_C4  (via drill 0.4)
  Top 0.305: 24.92,13.73 25.32,13.34 v25.32,12.62 | R4.1 41.67,12.86 v42.62,12.07 42.86,11.75 42.86,9.92 43.6,9.18 R2.1 | 21.27,17.23 PC4.1
  Top 0.406: JP2.5 23.96,13.89 | 24.92,13.73 23.95,13.73 JP2.5 | JP2.5 23.8,13.73 22.54,13.73 22.54,15.64 21.27,16.91 21.27,17.23
  Bottom 0.305: v25.32,12.62 25.64,12.31 27.62,12.31 29.05,12.31 30.32,12.31 31.11,13.1 38.42,13.1 39.21,12.31 42.39,12.31 v42.62,12.07
SPARE_C5  (via drill 0.4)
  Top 0.305: 26.35,11.27 v26.35,13.73 26.35,14.37 25.72,15.01 24.29,15.01 23.65,15.64 PC5.1 | R5.1 43.29,14.69 R3.1 44.34,14.16 45.24,13.26 v45.24,12.39 | PC5.1
  Top 0.406: 27.78,11.35 27.7,11.27 JP2.4 26.35,11.27
  Bottom 0.305: v26.35,13.73 26.99,13.1 30.32,13.1 30.96,13.73 38.58,13.73 39.37,12.94 44.69,12.94 v45.24,12.39
TXD  (via drill 0.4)
  Top 0.305: IC1.31 47.53,7.61 46.67,6.75 46.67,5.82 IC2.4 45.09,5.32 44.29,4.53 v44.29,3.57 | D7.1 67.31,6.48 67.31,5.48 66.75,4.92 63.74,4.92 62.55,3.73 v62.55,2.38
  Bottom 0.305: 62.39,2.23 v62.55,2.38 62.31,2.15 45.72,2.15 v44.29,3.57
VCC  (via drill 0.4)
  Top 0.305: PAD3.1 38.89,18.18 | 38.89,18.18
  Top 0.406: IC1.6 54.06,6.34 54.06,6.36 54.29,6.59 54.29,7.54 53.9,7.94 52.78,7.94 52.7,7.86 | R8.1 29.45,6.51 29.53,6.43 | 46.88,15.8 L1.1 | 41.12,1.51 41.91,0.72 47.94,0.72 49.95,2.73 C8.1 50.8,2.78 52.46,4.45 IC1.4 52.46,6.36 52.23,6.59 52.23,7.38 52.7,7.86 | 52.7,7.86
  Top 0.61: IC3.1 34.92,1.51 | IC3.1 33.66,1.51 32.38,1.51 32.38,5.96 32.38,6.43 29.53,6.43 27.78,6.43 | 38.89,18.18 PAD4.1 | JP2.2 26.66,6.43 27.78,6.43 | C1.1 27.78,4 27.78,6.43 | IC3.1 IC2.8 41.12,1.51 41.27,1.51 41.75,1.99 41.75,6.43 40.96,7.23 40.96,9.61 39.74,10.83 R1.2 | R1.2 | R1.2 R4.2 | R4.2 | R4.2 R5.2 39.74,15.8 | 39.74,15.8 39.74,17.41 PAD3.1 | 39.74,15.8 v40.64,15.8 | v45.96,15.8 46.88,15.8
  Bottom 0.61: v40.64,15.8 v45.96,15.8

### Text on the board
tNames: +18 | GND | GND | +5V | +5V | 7 | 6 | 1 | 32 | +18 | 16 | 1 | 8 | 6 | 4 | +18 | 2 | 6 | 1 | 1 | 1 | A | A | B | B
bStop: rd | PentaFn | CtrlBoard 0.91 | https://github.com/alxlo/PentaFnord